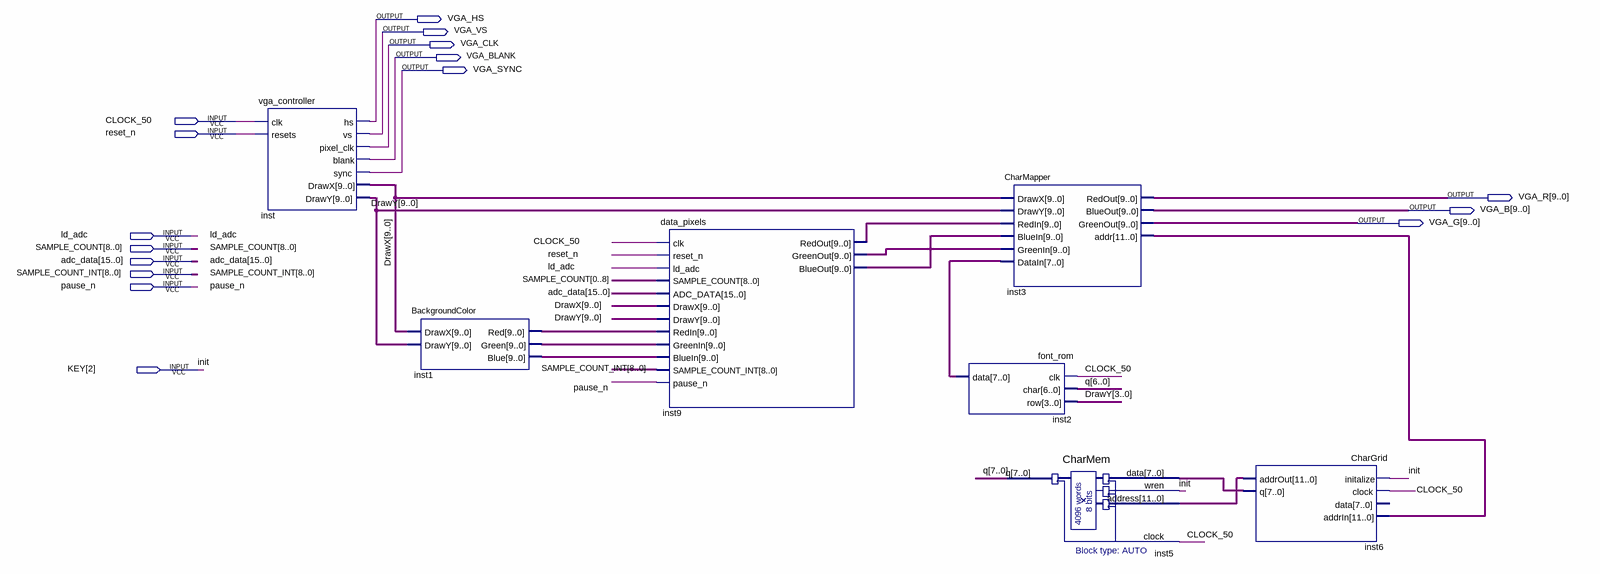
[diagram p0: schematic sheet]
// Quartus schematic VideoControllerBlk.bdf as structural Verilog: 7 symbols, 16 pins
module VideoControllerBlk (
  input  CLOCK_50,
  input  reset_n,
  input  ld_adc,
  input  [8:0] SAMPLE_COUNT,
  input  [15:0] adc_data,
  input  [8:0] SAMPLE_COUNT_INT,
  input  pause_n,
  input  [2:2] KEY,
  output VGA_HS,
  output VGA_VS,
  output VGA_CLK,
  output VGA_BLANK,
  output VGA_SYNC,
  output [9:0] VGA_R,
  output [9:0] VGA_B,
  output [9:0] VGA_G
);

  wire [7:0] inst2_data, inst6_q, q;
  wire [9:0] DrawX, DrawY, inst1_blue, inst1_green, inst1_red, inst9_blueout, inst9_greenout, inst9_redout;
  wire [11:0] inst3_addr, inst6_addrout;

  vga_controller inst (
    .clk(CLOCK_50), .resets(reset_n), .hs(VGA_HS), .vs(VGA_VS), .pixel_clk(VGA_CLK), .blank(VGA_BLANK),
    .sync(VGA_SYNC), .DrawX(DrawX), .DrawY(DrawY));
  BackgroundColor inst1 (.DrawX(DrawX), .DrawY(DrawY), .Red(inst1_red), .Green(inst1_green), .Blue(inst1_blue));
  data_pixels inst9 (
    .clk(CLOCK_50), .reset_n(reset_n), .ld_adc(ld_adc),
    .SAMPLE_COUNT({SAMPLE_COUNT[0], SAMPLE_COUNT[1], SAMPLE_COUNT[2], SAMPLE_COUNT[3], SAMPLE_COUNT[4], SAMPLE_COUNT[5], SAMPLE_COUNT[6], SAMPLE_COUNT[7], SAMPLE_COUNT[8]}),
    .ADC_DATA(adc_data), .DrawX(DrawX), .DrawY(DrawY), .RedIn(inst1_red), .GreenIn(inst1_green),
    .BlueIn(inst1_blue), .SAMPLE_COUNT_INT(SAMPLE_COUNT_INT), .pause_n(pause_n), .RedOut(inst9_redout),
    .GreenOut(inst9_greenout), .BlueOut(inst9_blueout));
  font_rom inst2 (.clk(CLOCK_50), .char(q[6:0]), .row(DrawY[3:0]), .data(inst2_data));
  CharMapper inst3 (
    .DrawX(DrawX), .DrawY(DrawY), .RedIn(inst9_redout), .BlueIn(inst9_blueout), .GreenIn(inst9_greenout),
    .DataIn(inst2_data), .RedOut(VGA_R), .BlueOut(VGA_B), .GreenOut(VGA_G), .addr(inst3_addr));
  CharMem inst5 (.data(inst6_q), .wren(KEY[2]), .address(inst6_addrout), .clock(CLOCK_50), .q(q));
  CharGrid inst6 (
    .initalize(KEY[2]), .clock(CLOCK_50), .addrIn(inst3_addr), .addrOut(inst6_addrout), .q(inst6_q));  // open: data

  // Other names for the same wires on the sheet: init = KEY[2]
endmodule
